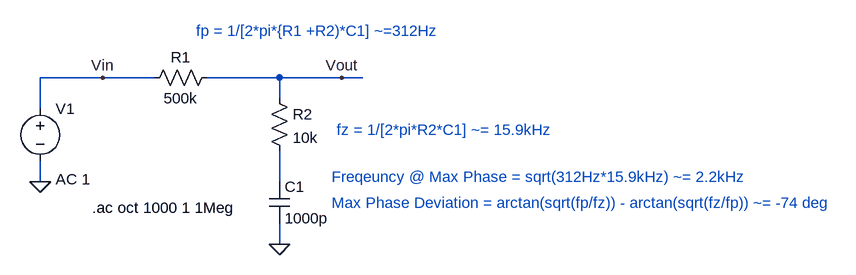
[diagram p0: schematic SimplePoleZeroPair.asc]
SimplePoleZeroPair.asc, the LTspice schematic file:
Version 4
SHEET 1 1312 680
WIRE 80 96 -16 96
WIRE 160 96 80 96
WIRE 352 96 240 96
WIRE 448 96 352 96
WIRE 480 96 448 96
WIRE 352 128 352 96
WIRE -16 144 -16 96
WIRE -16 256 -16 224
WIRE 352 256 352 208
WIRE 352 352 352 320
FLAG -16 256 0
FLAG 352 352 0
FLAG 80 96 Vin
FLAG 448 96 Vout
SYMBOL voltage -16 128 R0
WINDOW 123 24 124 Left 2
WINDOW 39 0 0 Left 0
SYMATTR Value2 AC 1
SYMATTR InstName V1
SYMATTR Value ""
SYMBOL res 256 80 R90
WINDOW 0 0 56 VBottom 2
WINDOW 3 32 56 VTop 2
SYMATTR InstName R1
SYMATTR Value 500k
SYMBOL res 336 112 R0
SYMATTR InstName R2
SYMATTR Value 10k
SYMBOL cap 336 256 R0
SYMATTR InstName C1
SYMATTR Value 1000p
TEXT 64 296 Left 2 !.ac oct 1000 1 1Meg
TEXT 224 24 Left 2 ;fp = 1/[2*pi*{R1 +R2)*C1] ~=312Hz
TEXT 440 176 Left 2 ;fz = 1/[2*pi*R2*C1] ~= 15.9kHz
TEXT 432 248 Left 2 ;Freqeuncy @ Max Phase = sqrt(312Hz*15.9kHz) ~= 2.2kHz
TEXT 432 288 Left 2 ;Max Phase Deviation = arctan(sqrt(fp/fz)) - arctan(sqrt(fz/fp)) ~= -74 deg

The netlist it stands for:
* SimplePoleZeroPair.asc
V1 Vin 0 AC 1
R1 Vout Vin 500k
R2 Vout N001 10k
C1 N001 0 1000p
.ac oct 1000 1 1Meg
* fp = 1/[2*pi*{R1 +R2)*C1] ~=312Hz
* fz = 1/[2*pi*R2*C1] ~= 15.9kHz
* Freqeuncy @ Max Phase = sqrt(312Hz*15.9kHz) ~= 2.2kHz
* Max Phase Deviation = arctan(sqrt(fp/fz)) - arctan(sqrt(fz/fp)) ~= -74 deg
.backanno
.end